# Altium schematic sheet Industrial Serial Comm (RS485).SchDoc
size A4; SheetNumber: 7; SheetTotal: 10
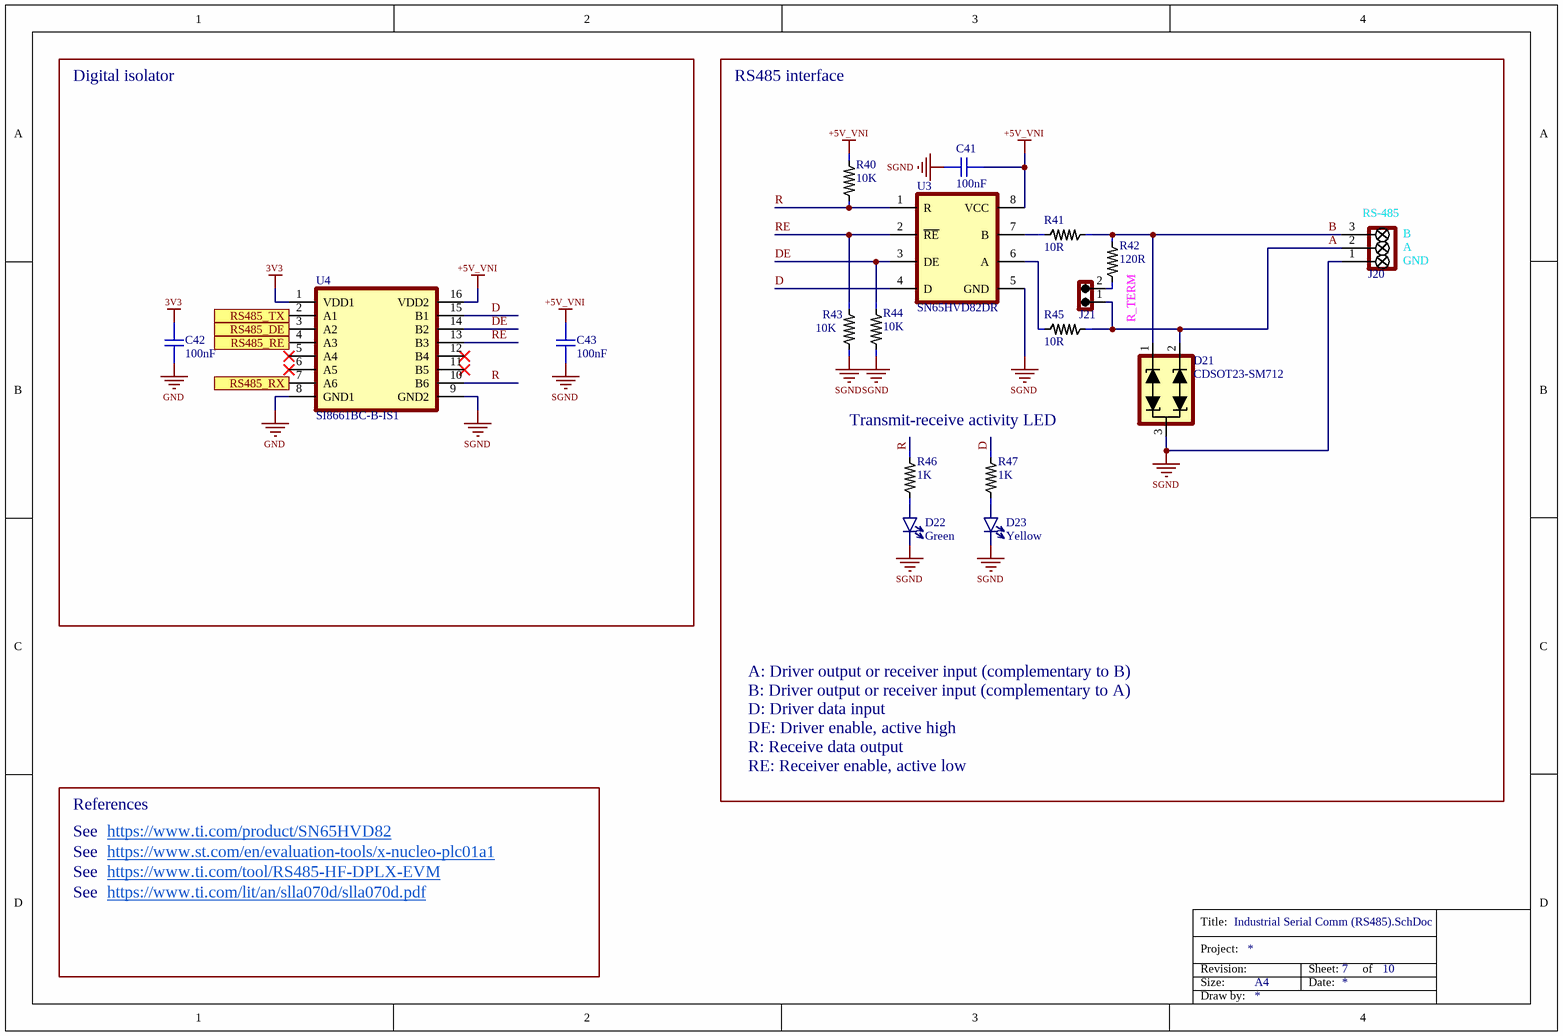
[diagram p0: Industrial Serial Comm (RS485).SchDoc]

## Parts
C41  value 100nF  [CAPC1005N]  (hidden comment: Multilayer Ceramic Capacitors)
C42  value 100nF  [CAPC1005N]  (hidden comment: Multilayer Ceramic Capacitors)
C43  value 100nF  [CAPC1005N]  (hidden comment: Multilayer Ceramic Capacitors)
D21  Part Number: CDSOT23-SM712  [SOT95P230X117-3N]  (hidden comment: ESD Protection Diodes)
D22  value Green  [LEDC1608X80N_GREEN]  (hidden comment: Single Color LED)
D23  value Yellow  [LEDC1608X80N_YELLOW]  (hidden comment: Single Color LED)
J20  Terminal Blocks  [CONB_FIX508P-3N]  (value not drawn)
J21  Male straight header  [CONH_ML254P-2N]  (value not drawn)
R40  value 10K  [RESC1005N]  (hidden comment: Thick Film Resistors)
R41  value 10R  [RESC2012N]  (hidden comment: Thick Film Resistors)
R42  value 120R  [RESC1005N]  (hidden comment: Thick Film Resistors)
R43  value 10K  [RESC1005N]  (hidden comment: Thick Film Resistors)
R44  value 10K  [RESC1005N]  (hidden comment: Thick Film Resistors)
R45  value 10R  [RESC2012N]  (hidden comment: Thick Film Resistors)
R46  value 1K  [RESC1005N]  (hidden comment: Thick Film Resistors)
R47  value 1K  [RESC1005N]  (hidden comment: Thick Film Resistors)
U3  Part Number: SN65HVD82DR  [SOIC127P600X175-8N]  (hidden comment: RS-485 Interface)
U4  Part Number: SI8661BC-B-IS1  [SOIC127P1030X265-16N]  (hidden comment: Digital Isolators)

## Blocks framed on the sheet
Digital isolator: C42 C43 U4

## Ports
RS485_DE (in, see Main[3B], Microcontroller (MCU)[2A]), RS485_RE (in, see Main[3B], Microcontroller (MCU)[2A]), RS485_RX (out, see Main[3B], Microcontroller (MCU)[2B]), RS485_TX (in, see Main[3B], Microcontroller (MCU)[2B])

## Nets
3V3: C42.1 U4.1(VDD1)
+5V_VNI: C41.1 C43.1 R40.2 U3.8(VCC) U4.16(VDD2)
GND: C42.2 U4.8(GND1)
SGND: C41.2 C43.2 D21.3 D22.C D23.C J20.1 R43.1 R44.1 U3.5(GND) U4.9(GND2)
A: D21.2 J20.2 J21.1 R45.2
B: D21.1 J20.3 R41.2 R42.2
D: R47.2 U3.4(D) U4.15(B1)
DE: R44.2 U3.3(DE) U4.14(B2)
R: R40.1 R46.2 U3.1(R) U4.10(B6)
RE: R43.2 U3.2(~{RE}) U4.13(B3)
RS485_DE: U4.3(A2) ; port RS485_DE
RS485_RE: U4.4(A3) ; port RS485_RE
RS485_RX: U4.7(A6) ; port RS485_RX
RS485_TX: U4.2(A1) ; port RS485_TX
NetD22_A: D22.A R46.1
NetD23_A: D23.A R47.1
NetJ21_2: J21.2 R42.1
NetR41_1: R41.1 U3.7(B)
NetR45_1: R45.1 U3.6(A)

Not connected (* = marked no-connect by the designer): U4 5(A4)* 6(A5)* 11(B5)* 12(B4)*

## Notes on the sheet
- RS485 interface
- (near J20) RS-485
- (near J20) B
- (near J20) A
- (near J20) GND
- (near R42) R_TERM
- Transmit-receive activity LED
- A: Driver output or receiver input (complementary to B)
  B: Driver output or receiver input (complementary to A)
  D: Driver data input
  DE: Driver enable, active high
  R: Receive data output
  RE: Receiver enable, active low
- References
- See
- https://www.ti.com/product/SN65HVD82
- https://www.st.com/en/evaluation-tools/x-nucleo-plc01a1
- https://www.ti.com/tool/RS485-HF-DPLX-EVM
- https://www.ti.com/lit/an/slla070d/slla070d.pdf
- Title:
- Project:
- Revision:
- Size:
- A4
- Sheet:
- Date:
- of
- Draw by:

## Library data of the parts
C41-C43 = C-MLCC-100nF-50V-10%-0402: Multilayer Ceramic Capacitors MLCC - SMD/SMT 50 V 0.1uF X7R 0402 10%; Part Number: CC0402KRX5R9BB104; Manufacturer: YAGEO; Mounting Type: SMT; Mouser Part #: 603-CC402KRX5R9BB104; Digikey Part #: 311-3342-1-ND; JLCPCB Part #: C105882
D21 = D-CDSOT23-SM712: ESD Protection Diodes / TVS Diodes SOT-23 7V400W Low Capacitance; Manufacturer: Bourns; Mounting Type: SMT; Mouser Part #: 652-CDSOT23-SM712; Digikey Part #: CDSOT23-SM712CT-ND; JLCPCB Part #: C5122012
D22 = D-LED-GREEN-2V-20mA-0603: Standard Single Color LEDs 0603 Green; Part Number: LTST-C190KGKT; Manufacturer: LITEON; Mounting Type: SMT; Mouser Part #: 859-LTST-C190KGKT; Digikey Part #: 160-1435-1-ND; JLCPCB Part #: C125094
D23 = D-LED-YELLOW-2V-20mA-0603: Standard Single Color LEDs 0603 Yellow; Part Number: LTST-C190KSKT; Manufacturer: LITEON; Mounting Type: SMT; Mouser Part #: 859-LTST-C190KSKT; Digikey Part #: 160-1437-1-ND; JLCPCB Part #: C125095
J20 = J-03-5P08-TERM-F-VERT-TH: Pluggable Terminal Blocks 3 Pos 5.08mm pitch Through Hole Header; Manufacturer: Adam Tech; Part Number: EBA-03-D-BU-01; Mouser Part #: 737-EBA-03-D-BU-01; Mounting Type: THT; Digikey Part #: ED2610-ND; JLCPCB Part #: C8483
J21 = J-02-2P54-HDR-M-VERT-TH: Male straight header, 1 row, 2 positions, 2.54mm pitch, through-hole; Part Number: 10129378-902001BLF; Manufacturer: Amphenol FCI; Mounting Type: THT; Mouser Part #: 649-1012937890201BLF; Digikey Part #: 10129378-902001BLF-ND; JLCPCB Part #: C3324910
R40 R43 R44 = R-THICK-10K-62.5mW-1%-0402: Thick Film Resistors - SMD General Purpose Chip Resistor 0402, 10kOhms, 1%, 1/16W; Part Number: RC0402FR-0710KL; Manufacturer: YAGEO; Mounting Type: SMT; Mouser Part #: 603-RC0402FR-0710KL; Digikey Part #: 311-10.0KLRCT-ND; JLCPCB Part #: C60490
R41 R45 = R-THICK-HP-10R-500mW-1%-0805: Thick Film Resistors - SMD High Power Chip Resistor 0805, 10Ohms, 1%, 1/2W; Part Number: CRCW080510R0FKEAHP; Manufacturer: Vishay; Mouser Part #: 71-CRCW080510R0FKEAH; Digikey Part #: 541-10.0TCT-ND; JLCPCB Part #: C844598; Mounting Type: SMT
R42 = R-THICK-120R-62.5mW-1%-0402: Thick Film Resistors - SMD General Purpose Chip Resistor 0402, 120Ohms, 1%, 1/16W; Part Number: RC0402FR-07120RL; Manufacturer: YAGEO; Mounting Type: SMT; Mouser Part #: 603-RC0402FR-07120RL; Digikey Part #: 311-120LRCT-ND; JLCPCB Part #: C114758
R46 R47 = R-THICK-1K-62.5mW-1%-0402: Thick Film Resistors - SMD General Purpose Chip Resistor 0402, 1kOhms, 1%, 1/16W; Part Number: RC0402FR-071KL; Manufacturer: YAGEO; Mounting Type: SMT; Mouser Part #: 603-RC0402FR-071KL; Digikey Part #: 311-1.00KLRCT-ND; JLCPCB Part #: C106235
U3 = U-SN65HVD82DR: RS-485 Interface IC 5V-Supply; Manufacturer: Texas Instruments; Mounting Type: SMT; Mouser Part #: 595-SN65HVD82DR; Digikey Part #: 296-35043-1-ND; JLCPCB Part #: C73631
U4 = U-SI8661BC-B-IS1: Digital Isolators 3.75 kV 5 forward & 1 reverse 6-channel isolator; Manufacturer: Skyworks; Mounting Type: SMT; Mouser Part #: 634-SI8661BC-B-IS1; Digikey Part #: 336-2120-5-ND; JLCPCB Part #: C528656